# Altium schematic sheet PWR.SchDoc
size A; SheetNumber: 3; SheetTotal: 5
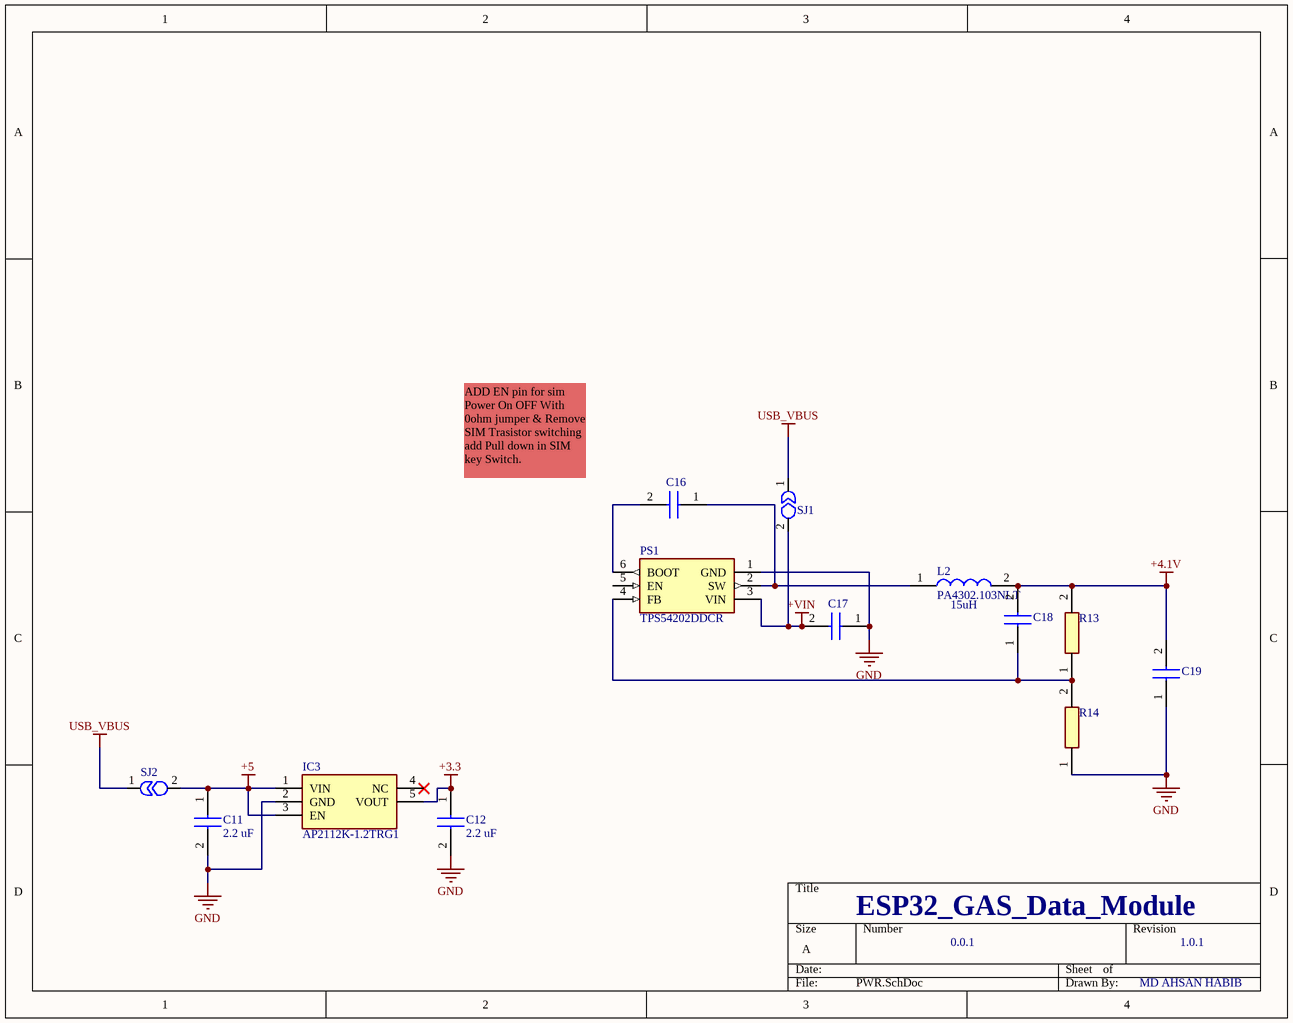
[diagram p0: PWR.SchDoc]

## Parts
C11  2.2 uF  [CAP0603]
C12  2.2 uF  [CAP0603]
C16  C0805C104M5RAC-TU  [CAPC2012X88N]  (value not drawn)
C17  C5750X5R1H106K230KA  [CAP0603]  (value not drawn)
C18  GRM0335C1E560JA01D  [CAP0603]  (value not drawn)
C19  GRM32ER61C476KE15L  [CAPC3225X270N]  (value not drawn)
IC3  AP2112K-1.2TRG1  [SOT95P285X140-5N]
L2  PA4302.103NLT  [PA4302103NLT]
PS1  TPS54202DDCR  [SOT95P280X110-6N]
R13  CRCW0402100KFKEDHP  [RES0603]  (value not drawn)
R14  CRCW040216K9FKEDHP  [RES0603]  (value not drawn)
SJ1  SOLDER_JUMPER_1206  [JUMP_SOLDER_JUMPER_1206]  (value not drawn)
SJ2  SOLDER_JUMPER_1206  [JUMP_SOLDER_JUMPER_1206]  (value not drawn)

## Nets
+3.3: C12.1 IC3.5(VOUT)
+4.1V: C18.2 C19.2 L2.2 R13.2
+5: C11.1 IC3.1(VIN) IC3.3(EN) SJ2.2
+VIN: C17.2 PS1.3(VIN) SJ1.2
GND: C11.2 C12.2 C17.1 C19.1 IC3.2(GND) PS1.1(GND) R14.1
USB_VBUS: SJ1.1 SJ2.1
NetC16_1: C16.1 L2.1 PS1.2(SW)
NetC16_2: C16.2 PS1.6(BOOT)
NetC18_1: C18.1 PS1.4(FB) R13.1 R14.2

Not connected (* = marked no-connect by the designer): IC3 4(NC)*; PS1 5(EN)

## Notes on the sheet
- ADD EN pin for sim Power On OFF With 0ohm jumper & Remove SIM Trasistor switching add Pull down in SIM key Switch.
- (near L2) 15uH
- ESP32_GAS_Data_Module
- 0.0.1
- 1.0.1
- MD AHSAN HABIB

## Library data of the parts
C11 C12 = CC0603KRX7R9BB104: Capacitor; Manufacturer_Name: YAGEO; Datasheet Link: https://componentsearchengine.com/Datasheets/2/CC0603KRX7R9BB104.pdf; Height: 0.9mm; Manufacturer_Part_Number: CC0603KRX7R9BB104; Mouser Part Number: 603-CC603KRX7R9BB104; Mouser Price/Stock: https://www.mouser.co.uk/ProductDetail/YAGEO/CC0603KRX7R9BB104?qs=vTakOoo5QyLvVCYM2ge8LQ%3D%3D; Arrow Part Number: CC0603KRX7R9BB104; Arrow Price/Stock: https://www.arrow.com/en/products/cc0603krx7r9bb104/yageo?utm_currency=USD&region=europe
C16 = C0805C104M5RAC-TU: Capacitor; Manufacturer_Name: Yageo Group; Datasheet Link: https://connect.kemet.com:7667/gateway/IntelliData-ComponentDocumentation/1.0/download/specsheet/C0805C104M5RACTU; Height: 0.88mm; Manufacturer_Part_Number: C0805C104M5RAC-TU; Arrow Part Number: C0805C104M5RAC-TU; Arrow Price/Stock: https://www.arrow.com/en/products/c0805c104m5ractu/kemet-corporation?region=nac
C17 = C5750X5R1H106K230KA: Capacitor; Manufacturer_Name: TDK; Datasheet Link: https://product.tdk.com/system/files/dam/doc/product/capacitor/ceramic/mlcc/catalog/mlcc_commercial_general_en.pdf; Height: 2.5mm; Manufacturer_Part_Number: C5750X5R1H106K230KA; Mouser Part Number: 810-C5750X5R1H106K; Mouser Price/Stock: https://www.mouser.co.uk/ProductDetail/TDK/C5750X5R1H106K230KA?qs=NRhsANhppD8lVYAvl0MZ3g%3D%3D; Arrow Part Number: C5750X5R1H106K230KA; Arrow Price/Stock: https://www.arrow.com/en/products/c5750x5r1h106k230ka/tdk?region=nac
C18 = GRM0335C1E560JA01D: Capacitor; Manufacturer_Name: Murata Electronics; Height: 0.33mm; Manufacturer_Part_Number: GRM0335C1E560JA01D; Mouser Part Number: 81-GRM0335C1E560JA1D; Mouser Price/Stock: https://www.mouser.com/Search/Refine.aspx?Keyword=81-GRM0335C1E560JA1D; Arrow Part Number: GRM0335C1E560JA01D; Arrow Price/Stock: https://www.arrow.com/en/products/grm0335c1e560ja01d/murata-manufacturing
C19 = GRM32ER61C476KE15L: Capacitor; Manufacturer_Name: Murata Electronics; Datasheet Link: https://search.murata.co.jp/Ceramy/image/img/A01X/G101/ENG/GRM32ER61C476KE15-01A.pdf; Height: 2.7mm; Manufacturer_Part_Number: GRM32ER61C476KE15L; Mouser Part Number: 81-GRM32ER61C476KE5L; Mouser Price/Stock: https://www.mouser.co.uk/ProductDetail/Murata-Electronics/GRM32ER61C476KE15L?qs=%252B%2F7tQhzlcy7Im%2F1Gh2YSGQ%3D%3D; Arrow Part Number: GRM32ER61C476KE15L; Arrow Price/Stock: https://www.arrow.com/en/products/grm32er61c476ke15l/murata-manufacturing?utm_currency=USD&region=europe
IC3 = AP2112K-1.2TRG1: Integrated Circuit; Manufacturer_Name: Diodes Incorporated; Datasheet Link: https://www.diodes.com/assets/Datasheets/AP2112.pdf; Height: 1.4mm; Manufacturer_Part_Number: AP2112K-1.2TRG1; Mouser Part Number: 621-AP2112K-1.2TRG1; Mouser Price/Stock: https://www.mouser.co.uk/ProductDetail/Diodes-Incorporated/AP2112K-1.2TRG1?qs=dZoB6MK9LKOx%252Blz%2FhgH2SA%3D%3D; Arrow Part Number: AP2112K-1.2TRG1; Arrow Price/Stock: https://www.arrow.com/en/products/ap2112k-1.2trg1/diodes-incorporated.html?utm_currency=USD&region=nac
L2 = PA4302.103NLT: Inductor; Manufacturer_Name: Yageo Group; Datasheet Link: https://www.mouser.com/datasheet/2/336/-559356.pdf; Height: 5.6mm; Manufacturer_Part_Number: PA4302.103NLT; Mouser Part Number: 673-PA4302.103NLT; Mouser Price/Stock: https://www.mouser.co.uk/ProductDetail/Pulse-Electronics/PA4302.103NLT?qs=ZU1dyKYMvyPXoPwo6qMOJg%3D%3D; Arrow Part Number: PA4302.103NLT; Arrow Price/Stock: https://www.arrow.com/en/products/pa4302.103nlt/pulse-electronics-corporation?region=nac
PS1 = TPS54202DDCR: Power Supply; Manufacturer_Name: Texas Instruments; Datasheet Link: http://www.ti.com/lit/gpn/tps54202; Height: 1.1mm; Manufacturer_Part_Number: TPS54202DDCR; Mouser Part Number: 595-TPS54202DDCR; Mouser Price/Stock: https://www.mouser.co.uk/ProductDetail/Texas-Instruments/TPS54202DDCR?qs=uP22XH7NdCsJtN%2Fq54jCtQ%3D%3D; Arrow Part Number: TPS54202DDCR; Arrow Price/Stock: https://www.arrow.com/en/products/tps54202ddcr/texas-instruments?utm_currency=USD&region=nac
R13 = CRCW0402100KFKEDHP: Resistor; Manufacturer_Name: Vishay; Datasheet Link: http://www.vishay.com/docs/20035/dcrcwe3.pdf; Height: 0.4mm; Manufacturer_Part_Number: CRCW0402100KFKEDHP; Mouser Part Number: 71-CRCW0402100KFKEDH; Mouser Price/Stock: https://www.mouser.co.uk/ProductDetail/Vishay-Dale/CRCW0402100KFKEDHP?qs=k2%2FDWSARqgGFakjlJe4Ejw%3D%3D; Arrow Part Number: CRCW0402100KFKEDHP; Arrow Price/Stock: https://www.arrow.com/en/products/crcw0402100kfkedhp/vishay?utm_currency=USD&region=nac
R14 = CRCW040216K9FKEDHP: Resistor; Manufacturer_Name: Vishay; Datasheet Link: http://www.vishay.com/docs/20035/dcrcwe3.pdf; Height: 0.4mm; Manufacturer_Part_Number: CRCW040216K9FKEDHP; Mouser Part Number: 71-CRCW040216K9FKEDH; Mouser Price/Stock: https://www.mouser.com/Search/Refine.aspx?Keyword=71-CRCW040216K9FKEDH
SJ1 SJ2 = SOLDER_JUMPER_1206: Package: None; Price: None; Value: *; MP: SOLDER_JUMPER_1206; Availability: Unavailable